# Altium project Servo-Board-v1.0.PrjPcb (part 11 of 19)

## Sheet DIO_2.SchDoc
size 420 x 297 mm; SheetNumber: 20; SheetTotal: 32
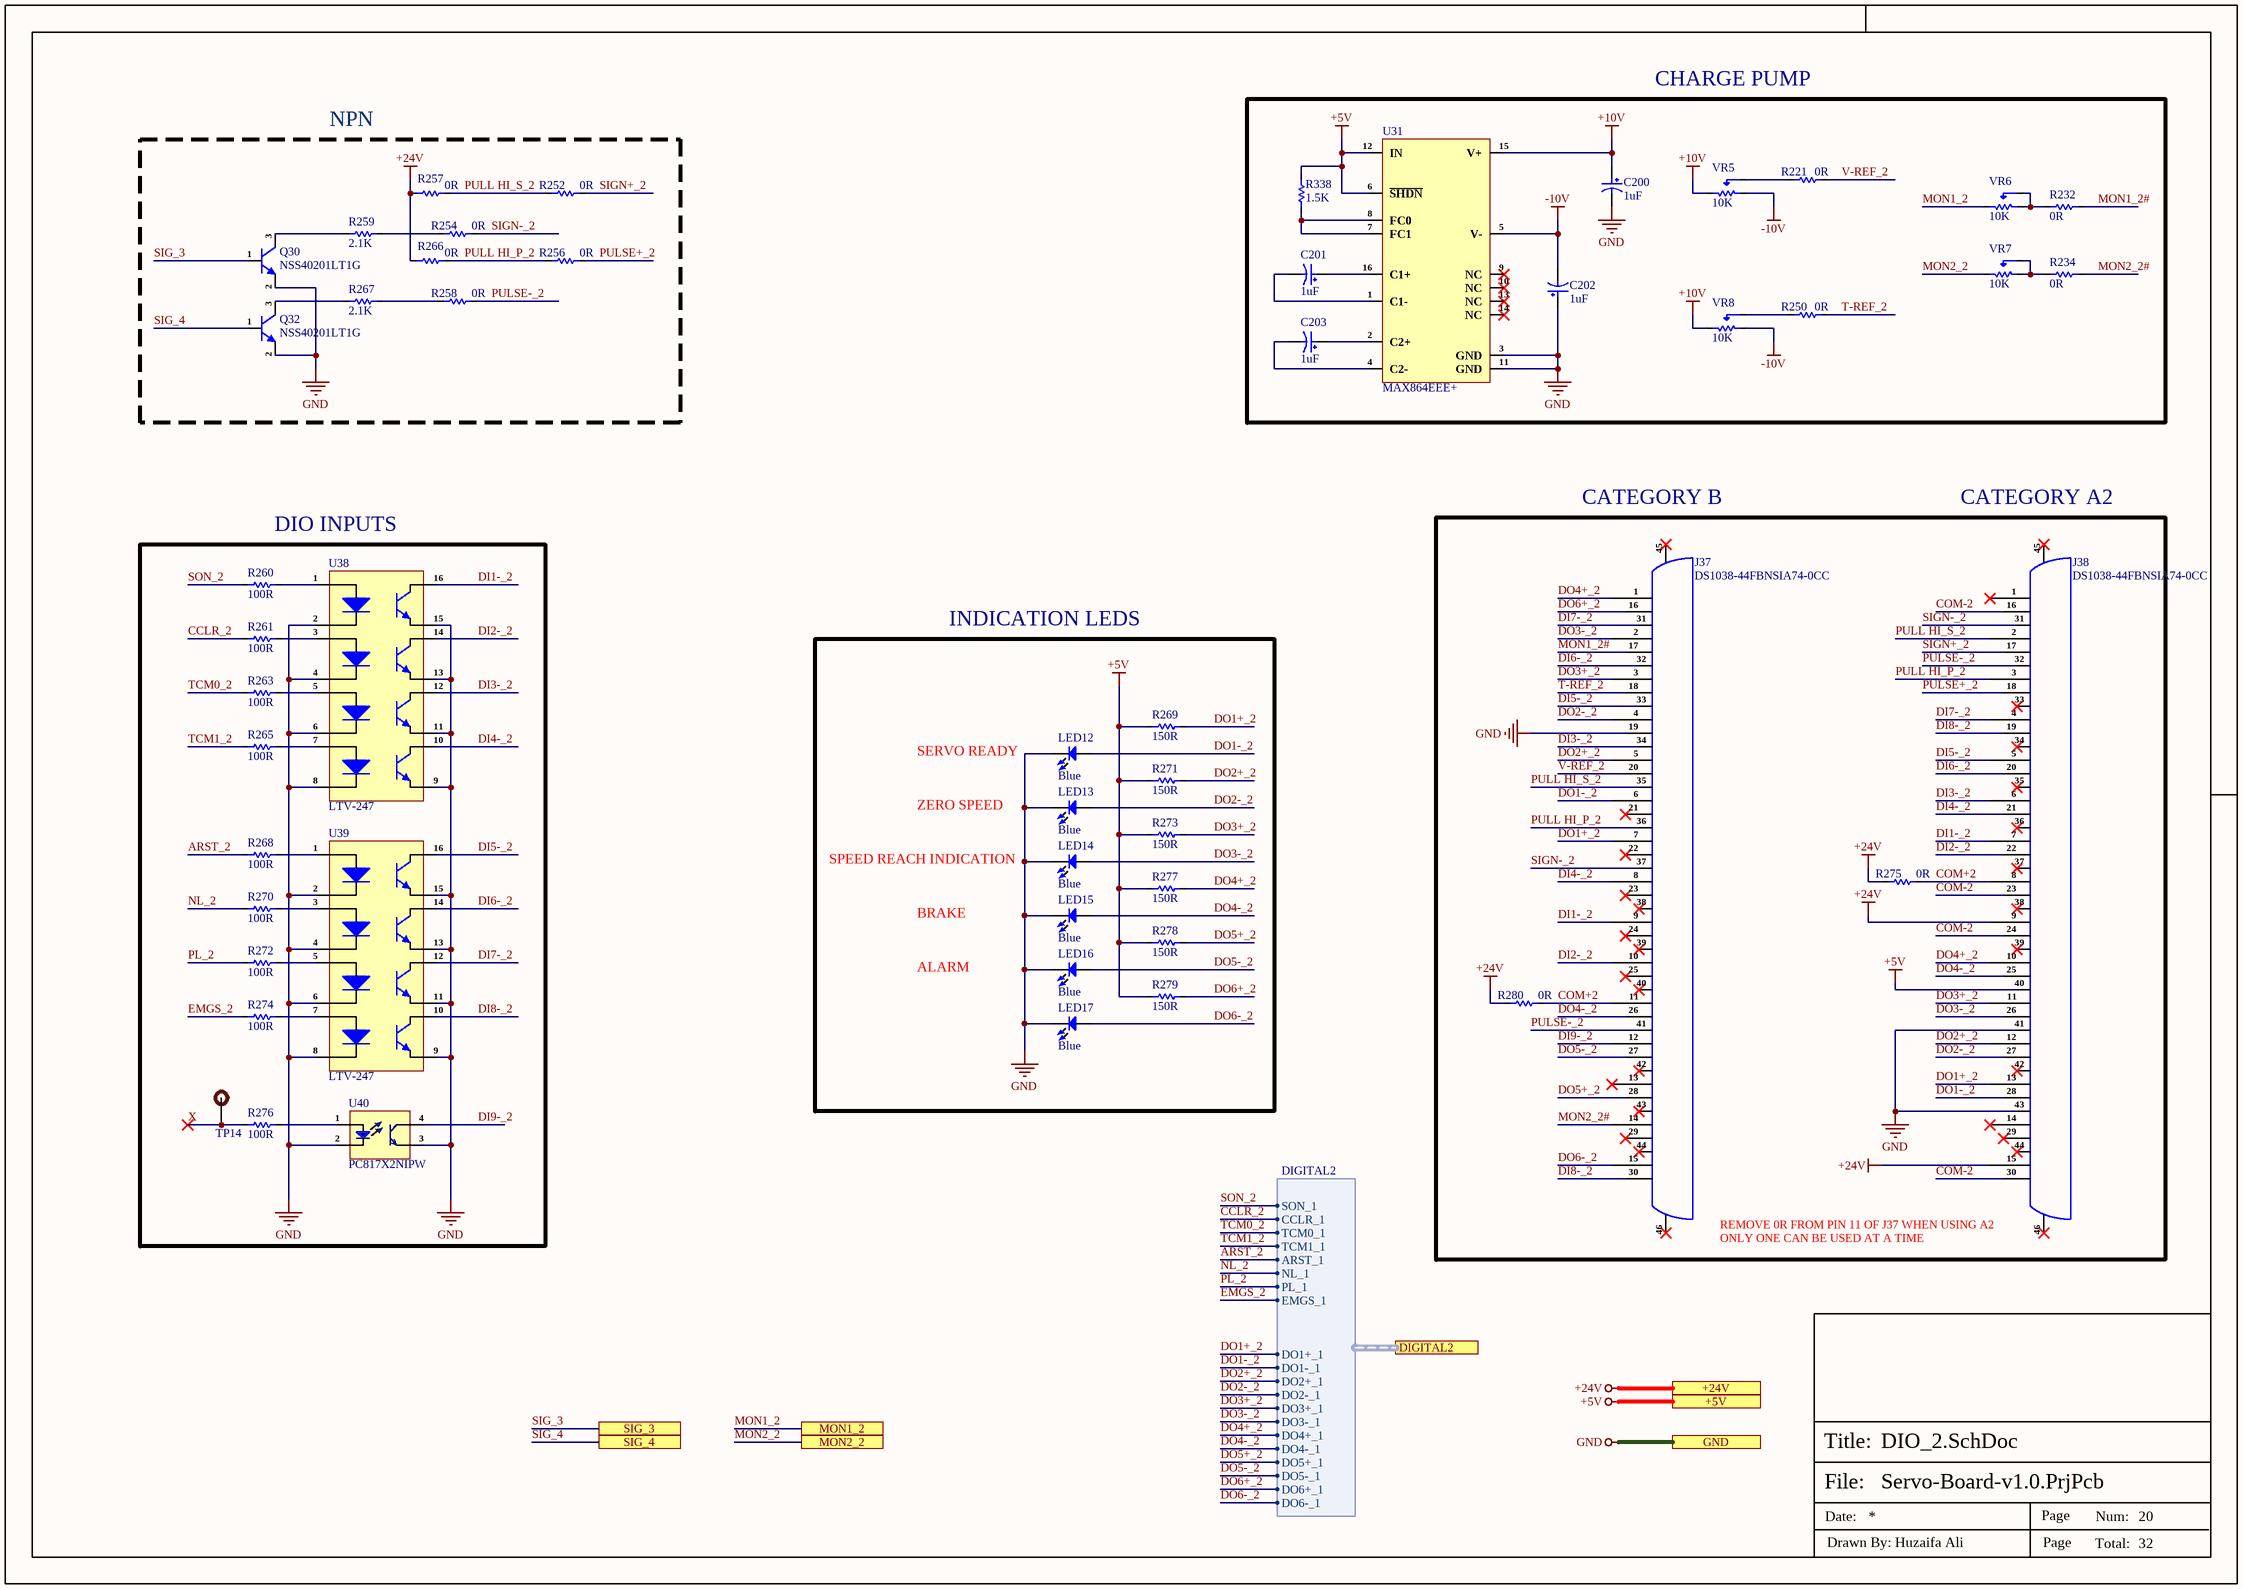
[diagram p19: DIO_2.SchDoc]

### Parts
C200  1uF  [RVT1H1R0M0405]
C201  1uF  [RVT1H1R0M0405]
C202  1uF  [RVT1H1R0M0405]
C203  1uF  [RVT1H1R0M0405]
J37  DS1038-44FBNSIA74-0CC  [DS1038-44FBNSIA74-0CC]
J38  DS1038-44FBNSIA74-0CC  [DS1038-44FBNSIA74-0CC]
LED12  Blue  [LED-0603]
LED13  Blue  [LED-0603]
LED14  Blue  [LED-0603]
LED15  Blue  [LED-0603]
LED16  Blue  [LED-0603]
LED17  Blue  [LED-0603]
Q30  NSS40201LT1G  [SOT-23]
Q32  NSS40201LT1G  [SOT-23]
R221  0R  [Res-0402]
R232  0R  [Res-0402]
R234  0R  [Res-0402]
R250  0R  [Res-0402]
R252  0R  [Res-0603]
R254  0R  [Res-0603]
R256  0R  [Res-0603]
R257  0R  [Res-0603]
R258  0R  [Res-0603]
R259  2.1K  [Res-0603]
R260  100R  [Res-0402]
R261  100R  [Res-0402]
R263  100R  [Res-0402]
R265  100R  [Res-0402]
R266  0R  [Res-0603]
R267  2.1K  [Res-0603]
R268  100R  [Res-0402]
R269  150R  [Res-0603]
R270  100R  [Res-0402]
R271  150R  [Res-0603]
R272  100R  [Res-0402]
R273  150R  [Res-0603]
R274  100R  [Res-0402]
R275  0R  [Res-0402]
R276  100R  [Res-0402]
R277  150R  [Res-0603]
R278  150R  [Res-0603]
R279  150R  [Res-0603]
R280  0R  [Res-0402]
R338  1.5K  [Res-0402]
TP14  TEST POINT  [Test-point]  (value not drawn)  (no BOM)
U31  MAX864EEE+  [16-QSOP]
U38  LTV-247  [16-SO]
U39  LTV-247  [16-SO]
U40  PC817X2NIPW  [PC817X2NIPW]
VR5  10K  [3362P-1-103]
VR6  10K  [3362P-1-103]
VR7  10K  [3362P-1-103]
VR8  10K  [3362P-1-103]

### Blocks framed on the sheet
NPN: Q30 Q32 R252 R254 R256-R259 R266 R267

### Ports
+5V (see Servo2[4C], CAN_Sheet[5D], DIO_1[5D], DIO_3[5D], DIO_4[5D], Encoder_Sheet1[5D], Encoder_Sheet2[5D], Encoder_Sheet3[5D], Encoder_Sheet4[5D], Power_Sheet[5D]), +24V (see Servo2[4C], Connector_Sheet[5D], DIO_1[5D], DIO_3[5D], DIO_4[5D], MOSFET_Driver_Sheet1[5D], MOSFET_Driver_Sheet2[5D], MOSFET_Driver_Sheet3[5D], MOSFET_Driver_Sheet4[5D], Motor_Driver_Sheet1[5D], Motor_Driver_Sheet2[5D], Motor_Driver_Sheet3[5D], Motor_Driver_Sheet4[5D], Power_Sheet[5D]), DIGITAL2 (harness DIGITAL2, see Servo2[4C], Sec_Controller_Sheet2[4D]), GND (see Servo2[4C], CAN_Sheet[5D], Connector_Sheet[5D], Controller_Sheet[5D], DIO_1[5D], DIO_3[5D], DIO_4[5D], Encoder_Sheet1[5D], Encoder_Sheet2[5D], Encoder_Sheet3[5D], Encoder_Sheet4[5D], EtherCAT_Sheet[5D], MOSFET_Driver_Sheet1[5D], MOSFET_Driver_Sheet2[5D], MOSFET_Driver_Sheet3[5D], MOSFET_Driver_Sheet4[5D], Motor_Driver_Sheet1[5D], Motor_Driver_Sheet2[5D], Motor_Driver_Sheet3[5D], Motor_Driver_Sheet4[5D], Power_Sheet[5D], RJ45_Sheet[5D], RS485_RS232_Sheet[3D], Sec_Controller_Sheet1[5D], Sec_Controller_Sheet2[5D], Sec_Controller_Sheet3[5D], Sec_Controller_Sheet4[5D]), MON1_2 (see Servo2[4C], Sec_Controller_Sheet2[3D]), MON2_2 (see Servo2[4C], Sec_Controller_Sheet2[3D]), SIG_3 (see Servo2[4C], Sec_Controller_Sheet2[3D]), SIG_4 (see Servo2[4C], Sec_Controller_Sheet2[3D])

### Harnesses
DIGITAL2: SON_1, TCM0_1, CCLR_1, TCM1_1, ARST_1, NL_1, PL_1, EMGS_1, DO1+_1, DO1-_1, DO2+_1, DO2-_1, DO3+_1, DO3-_1, DO4+_1, DO4-_1, DO5+_1, DO5-_1, DO6+_1, DO6-_1

### Nets
+5V: J38.40 R269.1 R271.1 R273.1 R277.1 R278.1 R279.1 R338.2 U31.6(~{SHDN}) U31.12(IN) ; port +5V
+10V: C200.1 U31.15(V+) VR5.3(CW) VR8.3(CW)
+24V: J38.9 J38.15 R257.1 R266.1 R275.1 R280.1 ; port +24V  [project net VDRAIN]
-10V: C202.2 U31.5(V-) VR5.1(CCW) VR8.1(CCW)
GND: C200.2 C202.1 J37.19 J38.41 J38.43 LED12.2 LED13.2 LED14.2 LED15.2 LED16.2 LED17.2 Q30.2(E) Q32.2(E) U31.3(GND) U31.11(GND) U38.2(K) U38.4(K) U38.6(K) U38.8(K) U38.9(E) U38.11(E) U38.13(E) U38.15(E) U39.2(K) U39.4(K) U39.6(K) U39.8(K) U39.9(E) U39.11(E) U39.13(E) U39.15(E) U40.2(Ca) U40.3(E) ; port GND
ARST_2: R268.1 ; port DIGITAL2.ARST_1
CCLR_2: R261.1 ; port DIGITAL2.CCLR_1
COM+2: J37.11 J38.8 R275.2 R280.2
COM-2: J38.16 J38.23 J38.24 J38.30
DI1-_2: J37.9 J38.7 U38.16(C)
DI2-_2: J37.10 J38.22 U38.14(C)
DI3-_2: J37.34 J38.6 U38.12(C)
DI4-_2: J37.8 J38.21 U38.10(C)
DI5-_2: J37.33 J38.5 U39.16(C)
DI6-_2: J37.32 J38.20 U39.14(C)
DI7-_2: J37.31 J38.4 U39.12(C)
DI8-_2: J37.30 J38.19 U39.10(C)
DI9-_2: J37.12 U40.4(C)
DO1+_2: J37.7 J38.13 R269.2 ; port DIGITAL2.DO1+_1
DO1-_2: J37.6 J38.28 LED12.1 ; port DIGITAL2.DO1-_1
DO2+_2: J37.5 J38.12 R271.2 ; port DIGITAL2.DO2+_1
DO2-_2: J37.4 J38.27 LED13.1 ; port DIGITAL2.DO2-_1
DO3+_2: J37.3 J38.11 R273.2 ; port DIGITAL2.DO3+_1
DO3-_2: J37.2 J38.26 LED14.1 ; port DIGITAL2.DO3-_1
DO4+_2: J37.1 J38.10 R277.2 ; port DIGITAL2.DO4+_1
DO4-_2: J37.26 J38.25 LED15.1 ; port DIGITAL2.DO4-_1
DO5+_2: J37.28 R278.2 ; port DIGITAL2.DO5+_1
DO5-_2: J37.27 LED16.1 ; port DIGITAL2.DO5-_1
DO6+_2: J37.16 R279.2 ; port DIGITAL2.DO6+_1
DO6-_2: J37.15 LED17.1 ; port DIGITAL2.DO6-_1
EMGS_2: R274.1 ; port DIGITAL2.EMGS_1
MON1_2: VR6.3(CW) ; port MON1_2
MON1_2#: J37.17 R232.2
MON2_2: VR7.3(CW) ; port MON2_2
MON2_2#: J37.14 R234.2
NL_2: R270.1 ; port DIGITAL2.NL_1
PL_2: R272.1 ; port DIGITAL2.PL_1
PULL HI_P_2: J37.36 J38.3 R256.1 R266.2
PULL HI_S_2: J37.35 J38.2 R252.1 R257.2
PULSE+_2: J38.18 R256.2
PULSE-_2: J37.41 J38.32 R258.2
SIG_3: Q30.1(B) ; port SIG_3
SIG_4: Q32.1(B) ; port SIG_4
SIGN+_2: J38.17 R252.2
SIGN-_2: J37.37 J38.31 R254.2
SON_2: R260.1 ; port DIGITAL2.SON_1
T-REF_2: J37.18 R250.2
TCM0_2: R263.1 ; port DIGITAL2.TCM0_1
TCM1_2: R265.1 ; port DIGITAL2.TCM1_1
V-REF_2: J37.20 R221.2
X: R276.1 TP14.1
NetC201_1: C201.1 U31.16(C1+)
NetC201_2: C201.2 U31.1(C1-)
NetC203_1: C203.1 U31.2(C2+)
NetC203_2: C203.2 U31.4(C2-)
NetQ30_3: Q30.3(C) R259.1
NetQ32_3: Q32.3(C) R267.1
NetR221_1: R221.1 VR5.2(Wiper)
NetR232_1: R232.1 VR6.1(CCW) VR6.2(Wiper)
NetR234_1: R234.1 VR7.1(CCW) VR7.2(Wiper)
NetR250_1: R250.1 VR8.2(Wiper)
NetR254_1: R254.1 R259.2
NetR258_1: R258.1 R267.2
NetR260_2: R260.2 U38.1(A)
NetR261_2: R261.2 U38.3(A)
NetR263_2: R263.2 U38.5(A)
NetR265_2: R265.2 U38.7(A)
NetR268_2: R268.2 U39.1(A)
NetR270_2: R270.2 U39.3(A)
NetR272_2: R272.2 U39.5(A)
NetR274_2: R274.2 U39.7(A)
NetR276_2: R276.2 U40.1(An)
NetR338_1: R338.1 U31.7(FC1) U31.8(FC0)

Not connected (* = marked no-connect by the designer): J37 13* 21* 22* 23* 24* 25* 29* 38* 39* 40* 42* 43* 44* 45* 46*; J38 1* 14* 29* 33* 34* 35* 36* 37* 38* 39* 42* 44* 45* 46*; U31 9(NC)* 10(NC)* 13(NC)* 14(NC)*

### Notes on the sheet
- CHARGE PUMP
- DIO INPUTS
- (near J37) CATEGORY B
- (near J38) CATEGORY A2
- INDICATION LEDS
- SERVO READY
- SPEED REACH INDICATION
- ZERO SPEED
- BRAKE
- ALARM
- REMOVE 0R FROM PIN 11 OF J37 WHEN USING A2
- ONLY ONE CAN BE USED AT A TIME
- File:
- Title:
- Date:
- Page
- Num:
- Total:
- Drawn By: Huzaifa Ali

### Library data of the parts
C200-C203 = RVT1H1R0M0405: 1uF 50V 8mA@120Hz ±20% SMD,D4xL5.4mm Aluminum Electrolytic Capacitors - SMD ROHS; Manufacturer: Roqang; Supplier: LCSC; LCSC Part Number: C72491; Manufacturer Part Number: RVT1H1R0M0405; RoHS: No
J37 J38 = DS1038-44FBNSIA74-0CC: 44P Female D-Sub Right-Angle 3 1.5A -40℃~+105℃ Push-Pull D-Sub / VGA connector ROHS; Manufacturer: CONNFLY Elec; Manufacturer Part Number: DS1038-44FBNSIA74-0CC; Package: Push-Pull; LCSC Part Number: C77844; Item Type: D-Sub / VGA connector; ComponentLink1Description: LCSC; ComponentLink1URL: https://www.lcsc.com/product-detail/D-Sub-VGA-connector_CONNFLY-Elec-DS1038-44FBNSIA74-0CC_C77844.html
LED12-LED17 = NCD0603B3: blue 0603 Light Emitting Diodes (LED) ROHS; Manufacturer: Foshan NationStar Optoelectronics; Manufacturer Part Number: NCD0603B3; Package: 0603; LCSC Part Number: C158101; Item Type: LED; ComponentLink1Description: LCSC; ComponentLink1URL: https://www.lcsc.com/product-detail/Light-Emitting-Diodes-LED_Foshan-NationStar-Optoelectronics-NCD0603B3_C158101.html
Q30 Q32 = NSS40201LT1G: TRANS NPN 40V 2A SOT23-3; Manufacturer: ON Semiconductor; Max Power Dissipation: 540mW; Transition Frequency: 150MHz; hFE Min: 200; Number of Elements: 1; Emitter Base Voltage (VEBO): 6V; Collector Emitter Saturation Voltage: 115mV; Element Configuration: Single; Clock Frequency: 100MHz; Item Type: Transistor; Supplier 1: Future Electronics; Manufacturer Part Number: NSS40201LT1G; RoHS: Yes; Category: BJTs; Stock 1: 155; Pricing 1: 1=0.42000, 15=0.34000, 75=0.29500, 300=0.25500, 1500=0.21000 (USD); Case/Package: SOT-23-3; Pins: 3; Min Operating Temperature: -55°C; Max Operating Temperature: 150°C; Collector Emitter Voltage (VCEO): 40V; Packaging: Tape and Reel; Max Collector Current: 2A; Collector Emitter Breakdown Voltage: 40V; Polarity: NPN; Package Quantity: 3000; Frequency: 150MHz; Max Breakdown Voltage: 40V; Collector Base Voltage (VCBO): 40V; Power Dissipation: 540mW; Gain Bandwidth Product: 150MHz; Series: -; Collector-emitter Voltage-Max: 115mV; Length: 3.04mm; Width: 2.64mm; Height: 1.11mm; Radiation Hardening: No; Lead Free: Lead Free; Reach SVHC Compliant: Yes; Halogen Free: Halogen Free; RoHS Compliant: Yes; ComponentLink1URL: https://datasheet.ciiva.com/976/nss40201l-d-976800.pdf?src-supplier=Digi-Key; ComponentLink1Description: https://datasheet.ciiva.com/976/nss40201l-d-976800.pdf?src-supplier=Digi-Key; ComponentLink2URL: https://datasheet.ciiva.com/11204/nss40201l-d-11204882.pdf?src-supplier=Avnet; ComponentLink2Description: https://datasheet.ciiva.com/11204/nss40201l-d-11204882.pdf?src-supplier=Avnet; ComponentLink3URL: https://datasheet.ciiva.com/16291/nss40201l-d-115376-16291797.pdf?src-supplier=Mouser; ComponentLink3Description: https://datasheet.ciiva.com/16291/nss40201l-d-115376-16291797.pdf?src-supplier=Mouser; ComponentLink4URL: https://datasheet.ciiva.com/30480/0900766b8121b5a5-30480502.pdf?src-supplier=Rs; ComponentLink4Description: https://datasheet.ciiva.com/30480/0900766b8121b5a5-30480502.pdf?src-supplier=Rs; ComponentLink5URL: https://datasheet.ciiva.com/976/nss40201l-d-976801.pdf?src-supplier=Digi-Key; ComponentLink5Description: https://datasheet.ciiva.com/976/nss40201l-d-976801.pdf?src-supplier=Digi-Key; ComponentLink6URL: https://datasheet.ciiva.com/976/nss40201l-d-976802.pdf?src-supplier=Digi-Key; ComponentLink6Description: https://datasheet.ciiva.com/976/nss40201l-d-976802.pdf?src-supplier=Digi-Key; ComponentLink7URL: https://datasheet.ciiva.com/22641/nss40201l-d-22641179.pdf?src-supplier=Farnell; ComponentLink7Description: https://datasheet.ciiva.com/22641/nss40201l-d-22641179.pdf?src-supplier=Farnell; ComponentLink8URL: https://datasheet.ciiva.com/16222/nss40201l-d-16222093.pdf?src-supplier=Future+Electronics; ComponentLink8Description: https://datasheet.ciiva.com/16222/nss40201l-d-16222093.pdf?src-supplier=Future+Electronics; Supplier Part Number 1: 6030674; LCSC Part Number: C145175
R221 R232 R234 R250 R275 R280 = RC0402FR-070RL: as R54 on sheet Sec_Controller_Sheet2; Supplier 1: Mouser; Manufacturer Part Number: RC0402FR-070RL; RoHS: Yes; Stock 1: 8556842; Pricing 1: 1=0.10000, 10=0.01400, 50=0.01400, 100=0.00600, 1000=0.00300, 5000=0.00200, 10000=0.00100 (USD); Mount: Surface Mount; Case/Package: 0402; Contact Plating: Tin,Matte; Case Code (Imperial): 0402; Case Code (Metric): 1005; Size Code: 0402; Min Operating Temperature: -55°C; Max Operating Temperature: 155°C; Resistance: 0R; Resistor Type: Thick Film; Packaging: Tape and Reel; Termination: SMD/SMT; Features: Moisture Resistant; Series: RC; Number of Terminations: 2; Length: 1mm; Width: 0.5mm; Height: 0.35mm; Radiation Hardening: No; Lead Free: Lead Free; RoHS Compliant: Yes; ComponentLink1URL: https://datasheet.ciiva.com/8896/pyu-rc0402-51-rohs-l-6-8896149.pdf?src-supplier=Avnet; ComponentLink1Description: https://datasheet.ciiva.com/8896/pyu-rc0402-51-rohs-l-6-8896149.pdf?src-supplier=Avnet; ComponentLink2URL: https://datasheet.ciiva.com/16790/pyu-rc0402-51-rohs-l-6-r-16790444.pdf?src-supplier=Future+Electronics; ComponentLink2Description: https://datasheet.ciiva.com/16790/pyu-rc0402-51-rohs-l-6-r-16790444.pdf?src-supplier=Future+Electronics; Supplier Part Number 1: 603-RC0402FR-070RL; LCSC Part Number: C106231
R252 R254 R256-R258 R266 = RC0603JR-070RL: as R55-R57 on sheet Sec_Controller_Sheet2; Supplier 1: Digi-Key; Manufacturer Part Number: RC0603JR-070RL; RoHS: Yes; Category: Chip SMD Resistors; Stock 1: 18081776; Pricing 1: 1=0.10000, 10=0.01700, 25=0.01240, 50=0.00960, 100=0.00700, 250=0.00536, 500=0.00430, 1000=0.00316 (USD); Case/Package: 0603; Number of Pins: 2; Contact Plating: Tin,Matte; Case Code (Imperial): 0603; Case Code (Metric): 1608; Size Code: 0603; Min Operating Temperature: -55°C; Max Operating Temperature: 155°C; Resistor Type: Thick Film; Packaging: Tape and Reel; Termination: SMD/SMT; Series: RC; Technology: THICK FILM; Package Quantity: 5000; Voltage Rating: 50V; Features: Moisture Resistant; Max Power Dissipation: 100mW; Number of Terminations: 2; Construction: Rectangular; Length: 1.6mm; Width: 0.8mm; Height: 0.45mm; Depth: 0.8mm; Radiation Hardening: No; Reach SVHC Compliant: No SVHC; Lead Free: Lead Free; RoHS Compliant: Yes; Military Standard: Not; Supplier Part Number 1: 311-0.0GRCT-ND; LCSC Part Number: C95177
R259 R267 = RT0603BRD072K1L: RES SMD 2.1K OHM 0.1% 1/10W 0603; Manufacturer: Yageo; Resistance: 2.1kR; Voltage Rating: 75V; Power Rating: 100mW; Temperature Coefficient: 25ppm/°C; Voltage Rating (DC): 50V; Item Type: Resistor; Supplier 1: Arrow Electronics; Manufacturer Part Number: RT0603BRD072K1L; RoHS: Yes; Category: Chip SMD Resistors; Stock 1: 4891; Pricing 1: 1=0.32000, 10=0.26320, 25=0.26040, 100=0.10310, 250=0.10280, 500=0.10180, 1000=0.06110, 3000=0.03900 (USD); Case/Package: 0603; Case Code (Imperial): 0603; Case Code (Metric): 1608; Min Operating Temperature: -55°C; Max Operating Temperature: 125°C; Tolerance: 0.1%; Packaging: Tape and Reel; Resistor Type: Thin Film; Number of Terminations: 2; Termination: SMD/SMT; Max Power Dissipation: 100mW; Features: Moisture Resistant; Series: RT; Construction: Rectangular; Length: 0.063inch; Width: 0.031inch; Height: 0.022inch; Depth: 0.8mm; Military Standard: Not; Lead Free: Lead Free; RoHS Compliant: Yes; ComponentLink1URL: https://datasheet.ciiva.com/12723/pyu-rt-1-to-0-05-rohs-l-4-12723880.pdf?src-supplier=Mouser; ComponentLink1Description: https://datasheet.ciiva.com/12723/pyu-rt-1-to-0-05-rohs-l-4-12723880.pdf?src-supplier=Mouser; Supplier Part Number 1: RT0603BRD072K1L; LCSC Part Number: C861293
R260 R261 R263 R265 R268 R270 R272 R274 R276 = RC0402FR-07100RL: RES 100 OHM 1% 1/16W 0402; Manufacturer: Yageo; Power Rating: 62.5mW; Voltage Rating: 50V; Temperature Coefficient: 100ppm/°C; Max Power Dissipation: 63mW; Item Type: Resistor; Supplier 1: Mouser; Manufacturer Part Number: RC0402FR-07100RL; RoHS: Yes; Category: Chip SMD Resistors; Stock 1: 699545; Pricing 1: 1=0.10000, 10=0.01200, 50=0.01200, 100=0.00500, 1000=0.00300, 2500=0.00200, 10000=0.00100 (USD); Case/Package: 0402; Number of Pins: 2; Case Code (Imperial): 0402; Case Code (Metric): 1005; Size Code: 0402; Min Operating Temperature: -55°C; Max Operating Temperature: 155°C; Tolerance: 1%; Voltage Rating (DC): 50V; Resistance: 100R; Packaging: Tape and Reel; Termination: SMD/SMT; Resistor Type: Thick Film; Features: Moisture Resistant; Series: RC; Number of Terminations: 2; Resistance Tolerance: 1%; Construction: Rectangular; Technology: THICK FILM; Length: 1mm; Width: 0.5mm; Height: 0.32mm; Depth: 0.5mm; RoHS Compliant: Yes; REACH SVHC: No SVHC; Military Standard: Not; Lead Free: Lead Free; ComponentLink1URL: https://datasheet.ciiva.com/11808/0900766b80c66297-11808765.pdf?src-supplier=RSComponents; ComponentLink1Description: https://datasheet.ciiva.com/11808/0900766b80c66297-11808765.pdf?src-supplier=RSComponents; ComponentLink2URL: https://datasheet.ciiva.com/7849/1784430-7849810.pdf?src-supplier=Element14; ComponentLink2Description: https://datasheet.ciiva.com/7849/1784430-7849810.pdf?src-supplier=Element14; ComponentLink3URL: https://datasheet.ciiva.com/28367/1018594-28367226.pdf?src-supplier=Element14; ComponentLink3Description: https://datasheet.ciiva.com/28367/1018594-28367226.pdf?src-supplier=Element14; ComponentLink4URL: https://datasheet.ciiva.com/22747/1018594-22747511.pdf?src-supplier=Element14; ComponentLink4Description: https://datasheet.ciiva.com/22747/1018594-22747511.pdf?src-supplier=Element14; ComponentLink5URL: https://datasheet.ciiva.com/12667/pyu-rc0402-51-rohs-l-6-r-12667957.pdf?src-supplier=Mouser; ComponentLink5Description: https://datasheet.ciiva.com/12667/pyu-rc0402-51-rohs-l-6-r-12667957.pdf?src-supplier=Mouser; ComponentLink6URL: https://datasheet.ciiva.com/15189/getdatasheetpartid-329466-15189335.pdf?src-supplier=Verical; ComponentLink6Description: https://datasheet.ciiva.com/15189/getdatasheetpartid-329466-15189335.pdf?src-supplier=Verical; ComponentLink7URL: https://datasheet.ciiva.com/16740/pyu-rc0402-51-rohs-l-6-r-16740566.pdf?src-supplier=Future+Electronics; ComponentLink7Description: https://datasheet.ciiva.com/16740/pyu-rc0402-51-rohs-l-6-r-16740566.pdf?src-supplier=Future+Electronics; Supplier Part Number 1: 603-RC0402FR-07100RL; LCSC Part Number: C106232
R269 R271 R273 R277-R279 = RC0603DR-07150RL: RES 150 OHM 0.5% 1/10W 0603; Manufacturer: Yageo; Max Power Dissipation: 100mW; Temperature Coefficient: 100ppm/°C; Item Type: Resistor; Supplier 1: Avnet; Manufacturer Part Number: RC0603DR-07150RL; RoHS: Yes; Category: Chip SMD Resistors; Pricing 1: 5000=0.00430, 10000=0.00424, 20000=0.00411 (USD); Case/Package: 0603; Min Operating Temperature: -55°C; Max Operating Temperature: 155°C; Packaging: Tape and Reel; Resistance: 150R; Resistor Type: Thick Film; Number of Terminations: 2; Tolerance: 0.5%; Features: Moisture Resistant; Length: 0.063inch; Width: 0.031inch; Height: 0.022inch; RoHS Compliant: Yes; ComponentLink1URL: http://www.yageo.com.tw/exep/pages/download/literatures/PYu-R_INT-thick_7.pdf?src-supplier=Digi-Key; ComponentLink1Description: http://www.yageo.com.tw/exep/pages/download/literatures/PYu-R_INT-thick_7.pdf?src-supplier=Digi-Key; Supplier Part Number 1: RC0603DR-07150RL; LCSC Part Number: C471801
R338 = RC0402FR-071K5L: RES 1.5K OHM 1% 1/16W 0402; Manufacturer: Yageo; Resistance: 1.5kR; Power Rating: 62.5mW; Voltage Rating: 50V; Temperature Coefficient: 100ppm/°C; Max Power Dissipation: 63mW; Supplier 1: Digi-Key; Manufacturer Part Number: RC0402FR-071K5L; RoHS: Yes; Category: Chip SMD Resistors; Stock 1: 2832947; Pricing 1: 1=0.10000, 10=0.01500, 100=0.00610, 1000=0.00275, 2500=0.00239, 5000=0.00197 (USD); Case/Package: 0402; Case Code (Metric): 1005; Case Code (Imperial): 0402; Size Code: 0402; Min Operating Temperature: -55°C; Max Operating Temperature: 155°C; Resistor Type: Thick Film; Package Quantity: 1; Tolerance: 1%; Packaging: Tape and Reel; Number of Terminations: 2; Termination: SMD/SMT; Features: Moisture Resistant; Series: RC; Resistance Tolerance: 1%; Construction: Rectangular; Technology: THICK FILM; Length: 1mm; Width: 0.02inch; Height: 0.016inch; Depth: 0.5mm; RoHS Compliant: Yes; REACH SVHC: No SVHC; Military Standard: Not; Lead Free: Lead Free; ComponentLink1URL: https://datasheet.ciiva.com/11808/0900766b80c66297-11808238.pdf?src-supplier=RSComponents; ComponentLink1Description: https://datasheet.ciiva.com/11808/0900766b80c66297-11808238.pdf?src-supplier=RSComponents; ComponentLink2URL: https://datasheet.ciiva.com/46394/1018594-46394950.pdf?src-supplier=Element14; ComponentLink2Description: https://datasheet.ciiva.com/46394/1018594-46394950.pdf?src-supplier=Element14; ComponentLink3URL: https://datasheet.ciiva.com/2453/pyu-r-int-thick-7-2453440.pdf?src-supplier=Digi-Key; ComponentLink3Description: https://datasheet.ciiva.com/2453/pyu-r-int-thick-7-2453440.pdf?src-supplier=Digi-Key; ComponentLink4URL: https://datasheet.ciiva.com/2453/pyu-r-int-thick-7-2453441.pdf?src-supplier=Digi-Key; ComponentLink4Description: https://datasheet.ciiva.com/2453/pyu-r-int-thick-7-2453441.pdf?src-supplier=Digi-Key; ComponentLink5URL: https://datasheet.ciiva.com/2453/pyu-r-int-thick-7-2453439.pdf?src-supplier=Digi-Key; ComponentLink5Description: https://datasheet.ciiva.com/2453/pyu-r-int-thick-7-2453439.pdf?src-supplier=Digi-Key; ComponentLink6URL: https://datasheet.ciiva.com/12558/pyu-rc0402-51-rohs-l-6-r-8721-12558542.pdf?src-supplier=Mouser; ComponentLink6Description: https://datasheet.ciiva.com/12558/pyu-rc0402-51-rohs-l-6-r-8721-12558542.pdf?src-supplier=Mouser; ComponentLink7URL: https://datasheet.ciiva.com/7849/1018594-7849863.pdf?src-supplier=Element14; ComponentLink7Description: https://datasheet.ciiva.com/7849/1018594-7849863.pdf?src-supplier=Element14; ComponentLink8URL: https://datasheet.ciiva.com/7849/1018594-7849864.pdf?src-supplier=Element14; ComponentLink8Description: https://datasheet.ciiva.com/7849/1018594-7849864.pdf?src-supplier=Element14; ComponentLink9URL: https://datasheet.ciiva.com/15189/getdatasheetpartid-323992-15189370.pdf?src-supplier=Verical; ComponentLink9Description: https://datasheet.ciiva.com/15189/getdatasheetpartid-323992-15189370.pdf?src-supplier=Verical; Supplier Part Number 1: 311-1.50KLRCT-ND; LCSC Part Number: C114759
TP14 = TEST POINT: Test Point ON; Item Type: TEST POINT
U31 = MAX864EEE+: IC REG CHARGE PUMP INV 16QSOP; Manufacturer: Maxim; Output Current: 20mA; Output Voltage: 12V; Logic Function: Inverting; Number of Outputs: 2; Switching Frequency: 185kHz; Synchronous Rectifier: No; Topology: Boost; Output Type: Adjustable; Max Supply Voltage: 6V; Min Supply Voltage: 1.75V; Operating Supply Current: 7mA; Min Output Voltage: 3.5V; Supplier: Digikey; Supplier Part Number: MAX864EEE+-ND; Manufacturer Part Number: MAX864EEE+; RoHS: Yes; Item Type: IC; Stock: 443; Pricing: 1=4.9, 10=4.399, 25=4.1588, 100=3.6042, 300=3.41937, 500=3.06818, 1000=2.58762, 2500=2.45824 (USD); Mounting Technology: Surface Mount; Case/Package: QSOP; Pins: 16; Weight: 0.010159oz; Min Operating Temperature: -40°C; Max Operating Temperature: 85°C; Packaging: Rail/Tube; Package Quantity: 100; Series: -; Min Input Voltage: 1.75V; Max Output Voltage: 12V; Termination: SMD/SMT; Length: 4.98mm; Width: 3.99mm; Height: 1.55mm; Radiation Hardening: No; Lead Free: Lead Free; RoHS Compliant: Yes; Reach SVHC Compliant: No; ComponentLink1URL: https://datasheet.ciiva.com/3215/max864-3215728.pdf?src-supplier=Avnet; ComponentLink1Description: https://datasheet.ciiva.com/3215/max864-3215728.pdf?src-supplier=Avnet; ComponentLink2URL: https://datasheet.ciiva.com/3216/max864-3216791.pdf?src-supplier=Avnet; ComponentLink2Description: https://datasheet.ciiva.com/3216/max864-3216791.pdf?src-supplier=Avnet; ComponentLink3URL: https://datasheet.ciiva.com/4874/max864-4874972.pdf?src-supplier=Mouser; ComponentLink3Description: https://datasheet.ciiva.com/4874/max864-4874972.pdf?src-supplier=Mouser; ComponentLink4URL: https://datasheet.ciiva.com/7994/9917-7994860.pdf?src-supplier=Element14; ComponentLink4Description: https://datasheet.ciiva.com/7994/9917-7994860.pdf?src-supplier=Element14
U38 U39 = LTV-247: OPTOISO 3.75KV 4CH TRANS 16SO; Manufacturer: Vishay Lite-On; Number of Channels: 4; Collector Emitter Voltage (VCEO): 80V; Reverse Breakdown Voltage: 6V; Forward Voltage: 1.2V; Forward Current: 20mA; Max Power Dissipation: 200mW; Output Current per Channel: 50mA; Collector Emitter Saturation Voltage: 400mV; Power Dissipation: 170mW; Current Transfer Ratio: 600%; Item Type: PhotoTransistor; Supplier 1: Future Electronics; Manufacturer Part Number: LTV-247; RoHS: Yes; Category: Optocouplers; Stock 1: 178000; Pricing 1: 2000=0.77000 (USD); Mount: Surface Mount; Case/Package: SMD/SMT; Number of Pins: 16; Min Operating Temperature: -55°C; Max Operating Temperature: 110°C; Package Quantity: 2000; Packaging: Tape and Reel; Max Output Voltage: 80V; Max Collector Current: 50mA; Number of Elements: 4; Max Input Current: 50mA; Radiation Hardening: No; RoHS Compliant: Yes; ComponentLink1URL: https://datasheet.ciiva.com/24015/ltv-247-256860-24015561.pdf?src-supplier=Mouser; ComponentLink1Description: https://datasheet.ciiva.com/24015/ltv-247-256860-24015561.pdf?src-supplier=Mouser; ComponentLink2URL: https://datasheet.ciiva.com/29730/ltv-214-244-29730320.pdf?src-supplier=Digi-Key; ComponentLink2Description: https://datasheet.ciiva.com/29730/ltv-214-244-29730320.pdf?src-supplier=Digi-Key; Supplier Part Number 1: 3051235; LCSC Part Number: C115451; ComponentLink3Description: LCSC; ComponentLink3URL: https://www.lcsc.com/product-detail/Optocouplers-Phototransistor-Output_Lite-On-LTV-247_C115451.html
U40 = PC817X2NIPW: Optoisolator Output Channel 4-SMD; Manufacturer: Sharp; Item Type: IC; Supplier: Mouser; Supplier Part Number: 852-PC817X2NIPW; Manufacturer Part Number: PC817X2NIPW; RoHS: No; Pricing: 1=0.54, 10=0.352, 50=0.352, 100=0.233, 1000=0.185, 10000=0.146 (USD); LCSC Part Number: C2840443
VR5-VR8 = 3362P-1-103: TRIMMER 10K OHM 0.5W PC PIN TOP; Manufacturer: Bourns; Item Type: Potentiometer; Supplier: Mouser; LCSC Part Number: C118956; Manufacturer Part Number: 3362P-1-103; RoHS: No; Stock: 1436; Pricing: 1=1.97, 10=1.44, 50=1.44, 100=1.13, 1000=0.756, 10000=0.756 (USD); ComponentLink1URL: https://datasheet.ciiva.com/19466/1931499-19466806.pdf?src-supplier=Jameco; ComponentLink1Description: https://datasheet.ciiva.com/19466/1931499-19466806.pdf?src-supplier=Jameco; ComponentLink2URL: https://datasheet.ciiva.com/3266/3362-3266710.pdf?src-supplier=Avnet; ComponentLink2Description: https://datasheet.ciiva.com/3266/3362-3266710.pdf?src-supplier=Avnet; ComponentLink3URL: https://datasheet.ciiva.com/2161/3362-2161230.pdf?src-supplier=Digikey; ComponentLink3Description: https://datasheet.ciiva.com/2161/3362-2161230.pdf?src-supplier=Digikey

## Sheet Servo3.SchDoc
size 420 x 297 mm; SheetNumber: 21; SheetTotal: 32
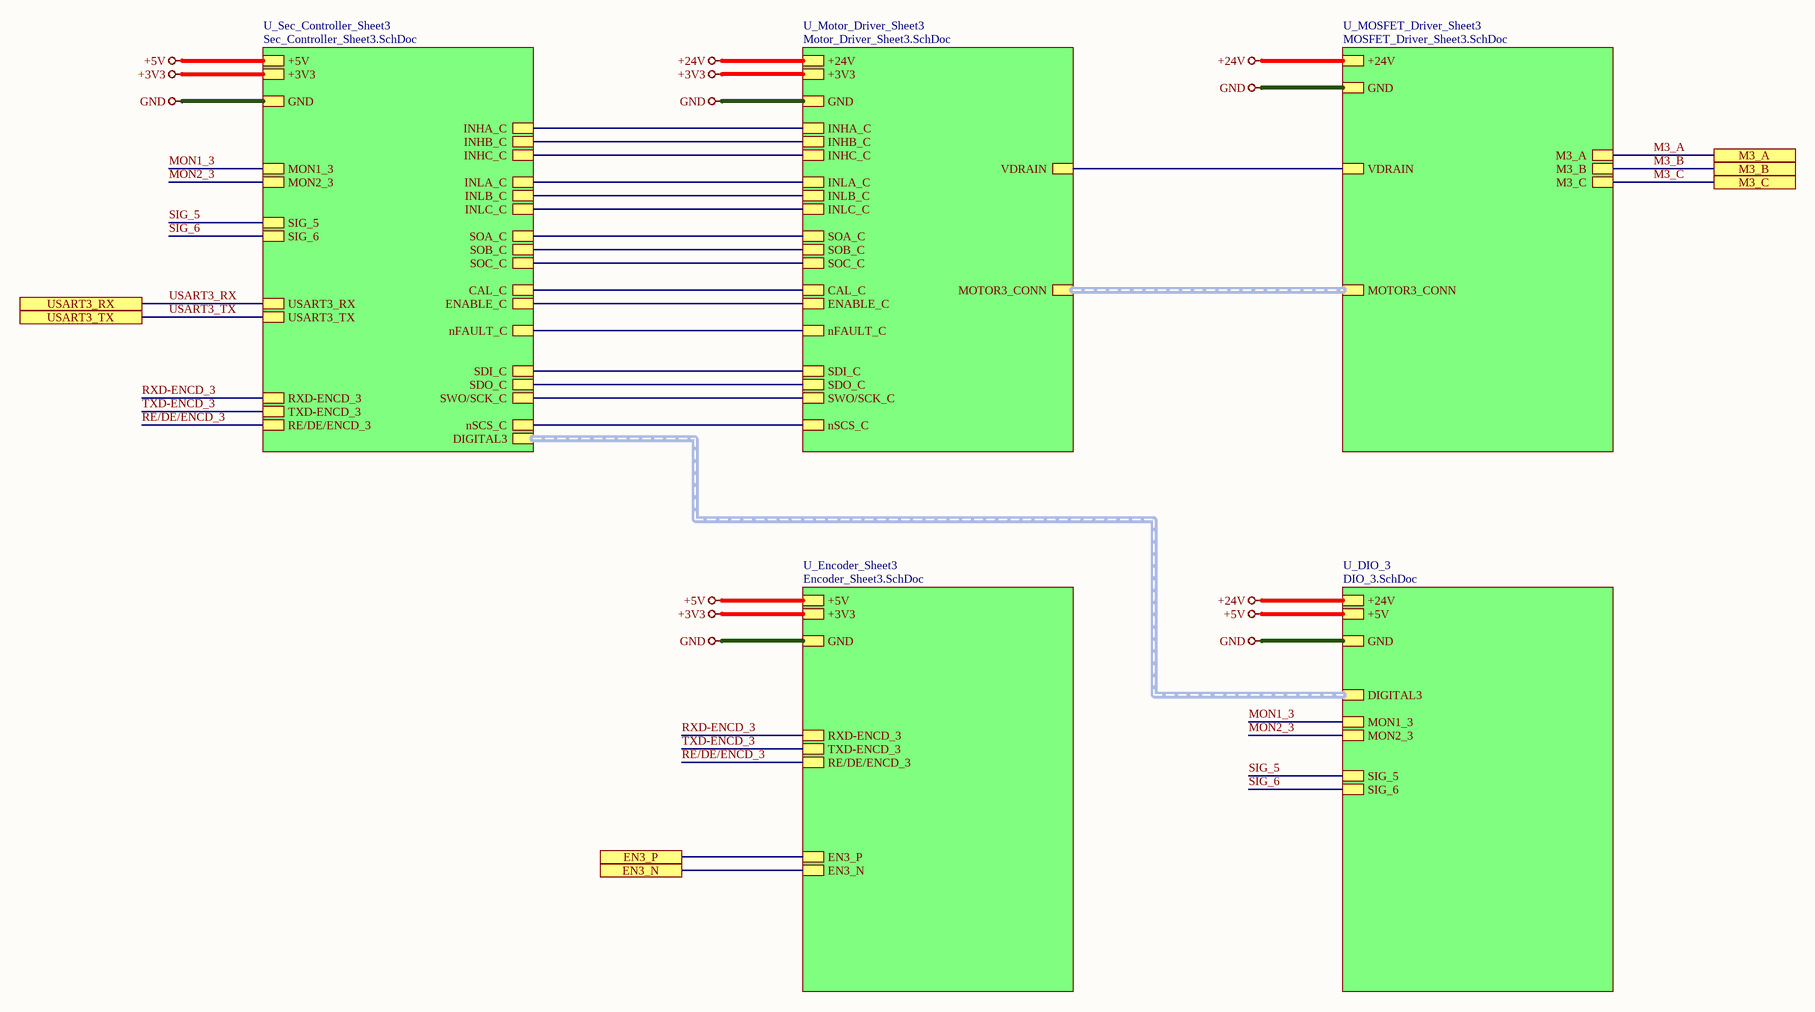
[diagram p20: Servo3.SchDoc]

### Sub-sheets
U_DIO_3 = DIO_3.SchDoc: +24V, +5V, GND, MON1_3, MON2_3, SIG_5, SIG_6, DIGITAL3 (harness DIGITAL1)
U_Encoder_Sheet3 = Encoder_Sheet3.SchDoc: +3V3, +5V, GND, EN3_N, EN3_P, RXD-ENCD_3, TXD-ENCD_3, RE/DE/ENCD_3
U_MOSFET_Driver_Sheet3 = MOSFET_Driver_Sheet3.SchDoc: +24V, GND, MOTOR3_CONN (harness MOTOR3_CONN), M3_A, M3_B, M3_C, VDRAIN
U_Motor_Driver_Sheet3 = Motor_Driver_Sheet3.SchDoc: +24V, +3V3, GND, MOTOR3_CONN (harness MOTOR3_CONN), INHA_C, INHB_C, INHC_C, INLA_C, INLB_C, INLC_C, nSCS_C, SDI_C, SDO_C, SWO/SCK_C, SOC_C, SOB_C, SOA_C, CAL_C, ENABLE_C, VDRAIN, nFAULT_C
U_Sec_Controller_Sheet3 = Sec_Controller_Sheet3.SchDoc: +3V3, GND, INHA_C, INHB_C, INHC_C, INLA_C, INLB_C, INLC_C, nSCS_C, SDI_C, SDO_C, SWO/SCK_C, SOC_C, SOB_C, SOA_C, CAL_C, ENABLE_C, nFAULT_C, USART3_RX, USART3_TX, RXD-ENCD_3, TXD-ENCD_3, RE/DE/ENCD_3, MON1_3, MON2_3, SIG_5, SIG_6, DIGITAL3 (harness DIGITAL1), +5V

### Ports
EN3_N (see Top_Sheet[4B], Connector_Sheet[3D], Encoder_Sheet3[2D]), EN3_P (see Top_Sheet[4B], Connector_Sheet[3D], Encoder_Sheet3[2D]), M3_A (see Top_Sheet[4C], Connector_Sheet[4D], MOSFET_Driver_Sheet3[3D]), M3_B (see Top_Sheet[4C], Connector_Sheet[4D], MOSFET_Driver_Sheet3[3D]), M3_C (see Top_Sheet[4C], Connector_Sheet[4D], MOSFET_Driver_Sheet3[3D]), USART3_RX (see Top_Sheet[4B], Controller_Sheet[2D], Sec_Controller_Sheet3[1D]), USART3_TX (see Top_Sheet[4B], Controller_Sheet[2D], Sec_Controller_Sheet3[1D])

### Nets
+3V3: sheet U_Motor_Driver_Sheet3/+3V3, sheet U_Sec_Controller_Sheet3/+3V3, sheet U_Encoder_Sheet3/+3V3
+5V: sheet U_Sec_Controller_Sheet3/+5V, sheet U_Encoder_Sheet3/+5V, sheet U_DIO_3/+5V
+24V: sheet U_MOSFET_Driver_Sheet3/+24V, sheet U_MOSFET_Driver_Sheet3/VDRAIN, sheet U_Motor_Driver_Sheet3/+24V, sheet U_Motor_Driver_Sheet3/VDRAIN, sheet U_DIO_3/+24V  [project net VDRAIN]
GND: sheet U_MOSFET_Driver_Sheet3/GND, sheet U_Motor_Driver_Sheet3/GND, sheet U_Sec_Controller_Sheet3/GND, sheet U_Encoder_Sheet3/GND, sheet U_DIO_3/GND
CAL_C: sheet U_Motor_Driver_Sheet3/CAL_C, sheet U_Sec_Controller_Sheet3/CAL_C
EN3_N: port EN3_N, sheet U_Encoder_Sheet3/EN3_N
EN3_P: port EN3_P, sheet U_Encoder_Sheet3/EN3_P
ENABLE_C: sheet U_Motor_Driver_Sheet3/ENABLE_C, sheet U_Sec_Controller_Sheet3/ENABLE_C
INHA_C: sheet U_Motor_Driver_Sheet3/INHA_C, sheet U_Sec_Controller_Sheet3/INHA_C
INHB_C: sheet U_Motor_Driver_Sheet3/INHB_C, sheet U_Sec_Controller_Sheet3/INHB_C
INHC_C: sheet U_Motor_Driver_Sheet3/INHC_C, sheet U_Sec_Controller_Sheet3/INHC_C
INLA_C: sheet U_Motor_Driver_Sheet3/INLA_C, sheet U_Sec_Controller_Sheet3/INLA_C
INLB_C: sheet U_Motor_Driver_Sheet3/INLB_C, sheet U_Sec_Controller_Sheet3/INLB_C
INLC_C: sheet U_Motor_Driver_Sheet3/INLC_C, sheet U_Sec_Controller_Sheet3/INLC_C
M3_A: port M3_A, sheet U_MOSFET_Driver_Sheet3/M3_A
M3_B: port M3_B, sheet U_MOSFET_Driver_Sheet3/M3_B
M3_C: port M3_C, sheet U_MOSFET_Driver_Sheet3/M3_C
MON1_3: sheet U_Sec_Controller_Sheet3/MON1_3, sheet U_DIO_3/MON1_3
MON2_3: sheet U_Sec_Controller_Sheet3/MON2_3, sheet U_DIO_3/MON2_3
nFAULT_C: sheet U_Motor_Driver_Sheet3/nFAULT_C, sheet U_Sec_Controller_Sheet3/nFAULT_C
nSCS_C: sheet U_Motor_Driver_Sheet3/nSCS_C, sheet U_Sec_Controller_Sheet3/nSCS_C
RE/DE/ENCD_3: sheet U_Sec_Controller_Sheet3/RE/DE/ENCD_3, sheet U_Encoder_Sheet3/RE/DE/ENCD_3
RXD-ENCD_3: sheet U_Sec_Controller_Sheet3/RXD-ENCD_3, sheet U_Encoder_Sheet3/RXD-ENCD_3
SDI_C: sheet U_Motor_Driver_Sheet3/SDI_C, sheet U_Sec_Controller_Sheet3/SDI_C
SDO_C: sheet U_Motor_Driver_Sheet3/SDO_C, sheet U_Sec_Controller_Sheet3/SDO_C
SIG_5: sheet U_Sec_Controller_Sheet3/SIG_5, sheet U_DIO_3/SIG_5
SIG_6: sheet U_Sec_Controller_Sheet3/SIG_6, sheet U_DIO_3/SIG_6
SOA_C: sheet U_Motor_Driver_Sheet3/SOA_C, sheet U_Sec_Controller_Sheet3/SOA_C
SOB_C: sheet U_Motor_Driver_Sheet3/SOB_C, sheet U_Sec_Controller_Sheet3/SOB_C
SOC_C: sheet U_Motor_Driver_Sheet3/SOC_C, sheet U_Sec_Controller_Sheet3/SOC_C
SWO/SCK_C: sheet U_Motor_Driver_Sheet3/SWO/SCK_C, sheet U_Sec_Controller_Sheet3/SWO/SCK_C
TXD-ENCD_3: sheet U_Sec_Controller_Sheet3/TXD-ENCD_3, sheet U_Encoder_Sheet3/TXD-ENCD_3
USART3_RX: port USART3_RX, sheet U_Sec_Controller_Sheet3/USART3_RX
USART3_TX: port USART3_TX, sheet U_Sec_Controller_Sheet3/USART3_TX

### Buses and harness runs
harness sheet U_DIO_3/DIGITAL3 = sheet U_Sec_Controller_Sheet3/DIGITAL3
harness sheet U_MOSFET_Driver_Sheet3/MOTOR3_CONN = sheet U_Motor_Driver_Sheet3/MOTOR3_CONN

### Notes on the sheet
- File:
- Title:
- Date:
- Page
- Num:
- Total:
- Drawn By: Huzaifa Ali

## Sheet MOSFET_Driver_Sheet3.SchDoc
size 420 x 297 mm; SheetNumber: 24; SheetTotal: 32
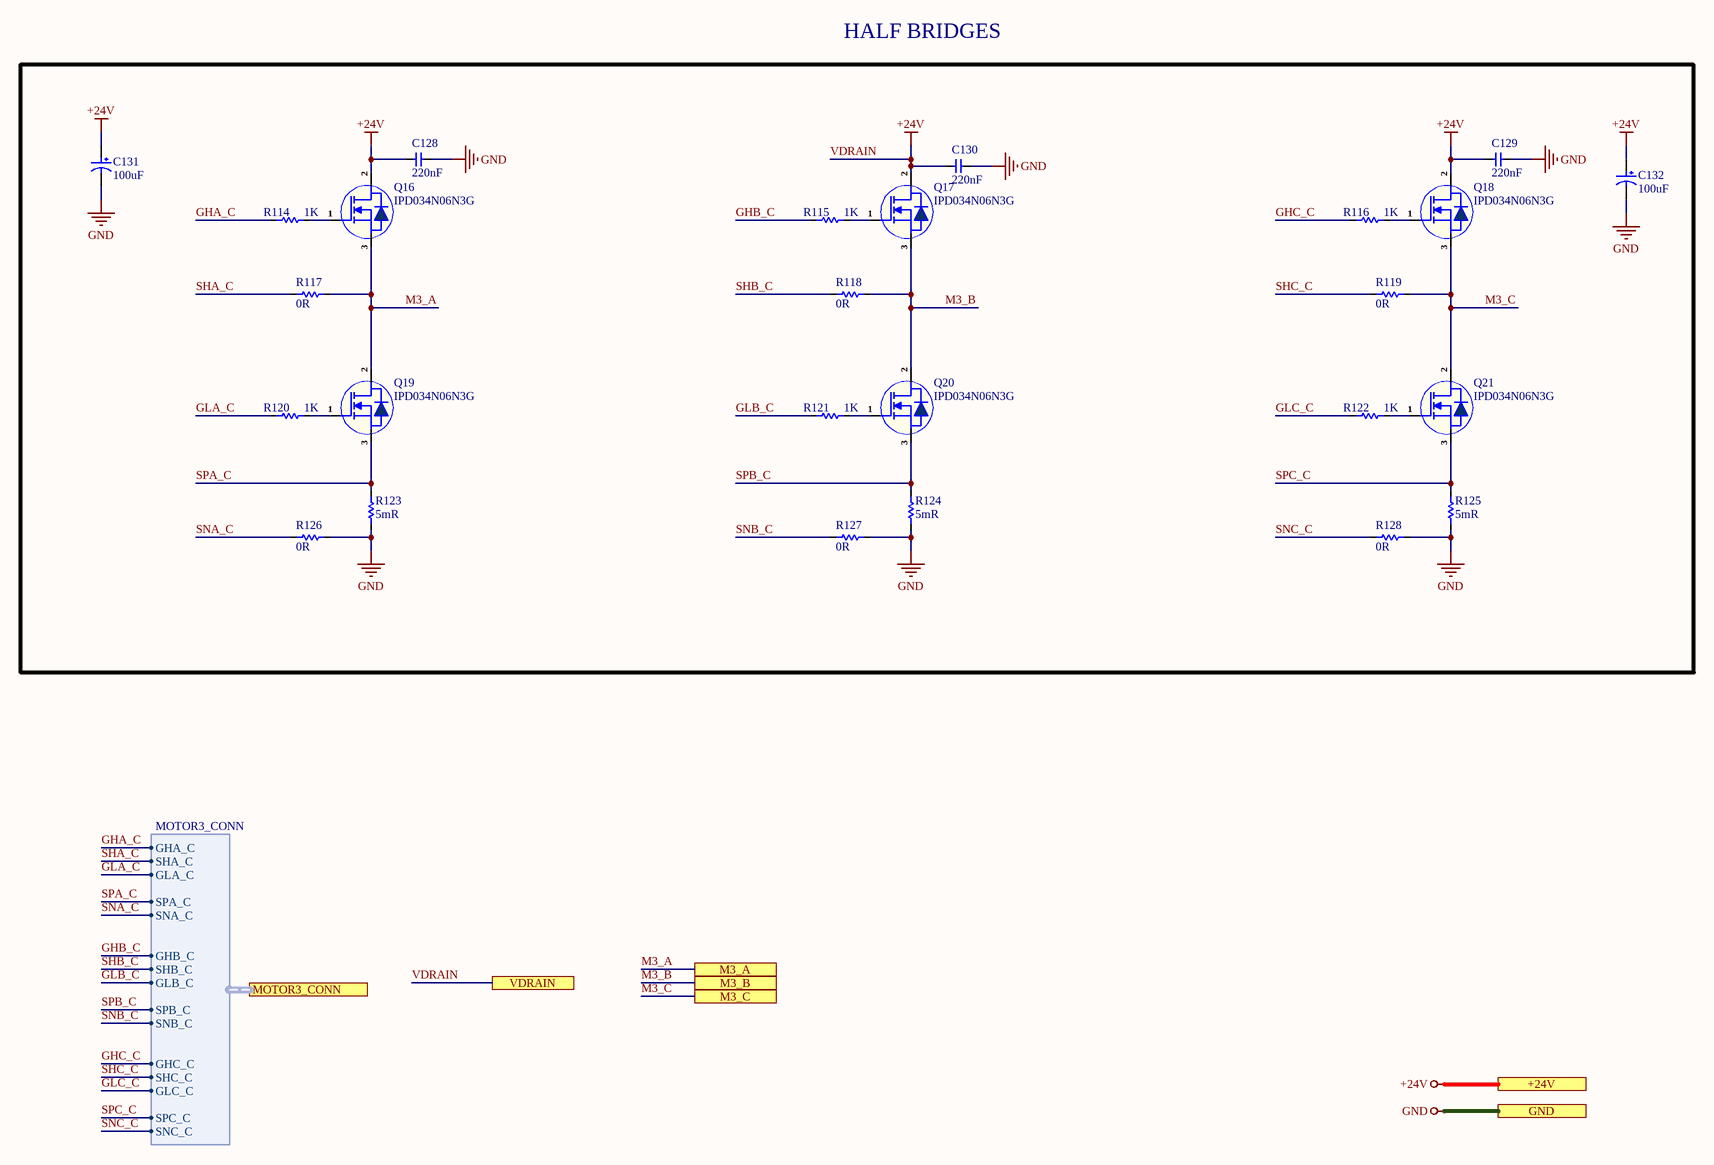
[diagram p21: MOSFET_Driver_Sheet3.SchDoc]

### Parts
C128  220nF  [Cap-0805]
C129  220nF  [Cap-0805]
C130  220nF  [Cap-0805]
C131  100uF  [RVT1A101M0605]
C132  100uF  [RVT1A101M0605]
Q16  IPD034N06N3G  [TO-252-2L]
Q17  IPD034N06N3G  [TO-252-2L]
Q18  IPD034N06N3G  [TO-252-2L]
Q19  IPD034N06N3G  [TO-252-2L]
Q20  IPD034N06N3G  [TO-252-2L]
Q21  IPD034N06N3G  [TO-252-2L]
R114  1K  [Res-0402]
R115  1K  [Res-0402]
R116  1K  [Res-0402]
R117  0R  [Res-0603]
R118  0R  [Res-0603]
R119  0R  [Res-0603]
R120  1K  [Res-0402]
R121  1K  [Res-0402]
R122  1K  [Res-0402]
R123  5mR  [Res-1206]
R124  5mR  [Res-1206]
R125  5mR  [Res-1206]
R126  0R  [Res-0603]
R127  0R  [Res-0603]
R128  0R  [Res-0603]

### Ports
+24V (see Servo3[4A], Connector_Sheet[5D], DIO_1[5D], DIO_2[5D], DIO_3[5D], DIO_4[5D], MOSFET_Driver_Sheet1[5D], MOSFET_Driver_Sheet2[5D], MOSFET_Driver_Sheet4[5D], Motor_Driver_Sheet1[5D], Motor_Driver_Sheet2[5D], Motor_Driver_Sheet3[5D], Motor_Driver_Sheet4[5D], Power_Sheet[5D]), GND (see Servo3[4B], CAN_Sheet[5D], Connector_Sheet[5D], Controller_Sheet[5D], DIO_1[5D], DIO_2[5D], DIO_3[5D], DIO_4[5D], Encoder_Sheet1[5D], Encoder_Sheet2[5D], Encoder_Sheet3[5D], Encoder_Sheet4[5D], EtherCAT_Sheet[5D], MOSFET_Driver_Sheet1[5D], MOSFET_Driver_Sheet2[5D], MOSFET_Driver_Sheet4[5D], Motor_Driver_Sheet1[5D], Motor_Driver_Sheet2[5D], Motor_Driver_Sheet3[5D], Motor_Driver_Sheet4[5D], Power_Sheet[5D], RJ45_Sheet[5D], RS485_RS232_Sheet[3D], Sec_Controller_Sheet1[5D], Sec_Controller_Sheet2[5D], Sec_Controller_Sheet3[5D], Sec_Controller_Sheet4[5D]), M3_A (see Servo3[5B], Connector_Sheet[4D], Servo3[5B]), M3_B (see Servo3[5B], Connector_Sheet[4D], Servo3[5B]), M3_C (see Servo3[5B], Connector_Sheet[4D], Servo3[5B]), MOTOR3_CONN (harness MOTOR3_CONN, see Servo3[4B], Motor_Driver_Sheet3[2D]), VDRAIN (see Servo3[4B], MOSFET_Driver_Sheet1[2D], MOSFET_Driver_Sheet2[2D], MOSFET_Driver_Sheet4[2D], Motor_Driver_Sheet1[2D], Motor_Driver_Sheet2[2D], Motor_Driver_Sheet3[2D], Motor_Driver_Sheet4[2D])

### Harnesses
MOTOR3_CONN: GHA_C, SHA_C, GLA_C, SPA_C, SNA_C, GHB_C, SHB_C, GLB_C, SPB_C, SNB_C, GHC_C, SHC_C, GLC_C, SPC_C, SNC_C

### Nets
GND: C128.1 C129.1 C130.1 C131.2 C132.2 R123.1 R124.1 R125.1 R126.1 R127.1 R128.1 ; port GND
VDRAIN: C128.2 C129.2 C130.2 C131.1 C132.1 Q16.2(D) Q17.2(D) Q18.2(D) ; port +24V, port VDRAIN  [also labelled +24V]
GHA_C: R114.1 ; port MOTOR3_CONN.GHA_C
GHB_C: R115.1 ; port MOTOR3_CONN.GHB_C
GHC_C: R116.1 ; port MOTOR3_CONN.GHC_C
GLA_C: R120.1 ; port MOTOR3_CONN.GLA_C
GLB_C: R121.1 ; port MOTOR3_CONN.GLB_C
GLC_C: R122.1 ; port MOTOR3_CONN.GLC_C
M3_A: Q16.3(S) Q19.2(D) R117.1 ; port M3_A
M3_B: Q17.3(S) Q20.2(D) R118.1 ; port M3_B
M3_C: Q18.3(S) Q21.2(D) R119.1 ; port M3_C
SHA_C: R117.2 ; port MOTOR3_CONN.SHA_C
SHB_C: R118.2 ; port MOTOR3_CONN.SHB_C
SHC_C: R119.2 ; port MOTOR3_CONN.SHC_C
SNA_C: R126.2 ; port MOTOR3_CONN.SNA_C
SNB_C: R127.2 ; port MOTOR3_CONN.SNB_C
SNC_C: R128.2 ; port MOTOR3_CONN.SNC_C
SPA_C: Q19.3(S) R123.2 ; port MOTOR3_CONN.SPA_C
SPB_C: Q20.3(S) R124.2 ; port MOTOR3_CONN.SPB_C
SPC_C: Q21.3(S) R125.2 ; port MOTOR3_CONN.SPC_C
NetQ16_1: Q16.1(G) R114.2
NetQ17_1: Q17.1(G) R115.2
NetQ18_1: Q18.1(G) R116.2
NetQ19_1: Q19.1(G) R120.2
NetQ20_1: Q20.1(G) R121.2
NetQ21_1: Q21.1(G) R122.2

### Notes on the sheet
- HALF BRIDGES
- File:
- Title:
- Date:
- Page
- Num:
- Total:
- Drawn By: Huzaifa Ali

### Library data of the parts
C128-C130 = 08051C224K4T2A: as C123-C125 on sheet MOSFET_Driver_Sheet2; Supplier 1: Digi-Key; Manufacturer Part Number: 08051C224K4T2A; RoHS: Yes; Category: Ceramic Capacitors; Stock 1: 151; Pricing 1: 1=0.27000, 10=0.18500, 50=0.12320, 100=0.10470, 500=0.07392, 1000=0.06468 (USD); Mount: Surface Mount; Case/Package: 0805; Contact Plating: Tin; Min Operating Temperature: -55°C; Max Operating Temperature: 125°C; Termination: Wraparound; Capacitance: 220nF; Dielectric: X7R; Voltage Rating (DC): 100V; Length: 2.01mm; RoHS Compliant: Yes; ComponentLink1URL: http://datasheets.avx.com/AutoMLCC.pdf?src-supplier=Avnet+Asia; ComponentLink1Description: http://datasheets.avx.com/AutoMLCC.pdf?src-supplier=Avnet+Asia; Supplier Part Number 1: 478-13049-1-ND; LCSC Part Number: C2176107
C131 C132 = RVT1A101M0605: as C126 on sheet MOSFET_Driver_Sheet2; Manufacturer Part Number: RVT1A101M0605; Package: SMD,D6.3xL5.4mm; LCSC Part Number: C72474; Item Type: Capacitor; ComponentLink1Description: LCSC; ComponentLink1URL: https://www.lcsc.com/product-detail/Aluminum-Electrolytic-Capacitors-SMD_ROQANG-RVT1A101M0605_C72474.html
Q16-Q21 = IPD034N06N3G: as Q10-Q15 on sheet MOSFET_Driver_Sheet2; Supplier: Mouser; Supplier Part Number: 726-IPD034N06N3G; Manufacturer Part Number: IPD034N06N3G; RoHS: Yes; Stock: 7587; Pricing: 1=1.76, 10=1.48, 50=1.48, 100=1.2, 1000=0.837, 10000=0.747 (USD); LCSC Part Number: C94897; Item Type: Mosfet
R114-R116 R120-R122 = RC0402FR-071KL: as R99-R101 on sheet MOSFET_Driver_Sheet2; Supplier 1: Avnet; Manufacturer Part Number: RC0402FR-071KL; RoHS: Yes; Category: Chip SMD Resistors; Stock 1: 13030000; Pricing 1: 10000=0.00085, 20000=0.00087, 40000=0.00084, 60000=0.00083, 80000=0.00079, 100000=0.00078, 1000000=0.00076 (USD); Case/Package: 0402; Number of Pins: 2; Case Code (Imperial): 0402; Case Code (Metric): 1005; Size Code: 0402; Min Operating Temperature: -55°C; Max Operating Temperature: 155°C; Resistor Type: Thick Film; Tolerance: 1%; Packaging: Tape and Reel; Voltage Rating: 50V; Termination: SMD/SMT; Features: Moisture Resistant; Series: RC; Number of Terminations: 2; Resistance Tolerance: 1%; Construction: Rectangular; Technology: THICK FILM; Length: 1mm; Width: 0.5mm; Height: 0.32mm; Depth: 0.5mm; Reach SVHC Compliant: Yes; Lead Free: Lead Free; RoHS Compliant: Yes; Military Standard: Not; ComponentLink1URL: https://datasheet.ciiva.com/11819/0900766b80c66297-11819477.pdf?src-supplier=RSComponents; ComponentLink1Description: https://datasheet.ciiva.com/11819/0900766b80c66297-11819477.pdf?src-supplier=RSComponents; ComponentLink2URL: https://datasheet.ciiva.com/7983/1018594-7983502.pdf?src-supplier=Element14; ComponentLink2Description: https://datasheet.ciiva.com/7983/1018594-7983502.pdf?src-supplier=Element14; ComponentLink3URL: https://datasheet.ciiva.com/22747/1018594-22747513.pdf?src-supplier=Element14; ComponentLink3Description: https://datasheet.ciiva.com/22747/1018594-22747513.pdf?src-supplier=Element14; ComponentLink4URL: https://datasheet.ciiva.com/12666/pyu-rc0402-51-rohs-l-6-r-12666741.pdf?src-supplier=Mouser; ComponentLink4Description: https://datasheet.ciiva.com/12666/pyu-rc0402-51-rohs-l-6-r-12666741.pdf?src-supplier=Mouser; ComponentLink5URL: https://datasheet.ciiva.com/7849/1018594-7849869.pdf?src-supplier=Element14; ComponentLink5Description: https://datasheet.ciiva.com/7849/1018594-7849869.pdf?src-supplier=Element14; ComponentLink6URL: https://datasheet.ciiva.com/7849/1018594-7849871.pdf?src-supplier=Element14; ComponentLink6Description: https://datasheet.ciiva.com/7849/1018594-7849871.pdf?src-supplier=Element14; ComponentLink7URL: https://datasheet.ciiva.com/17063/pyu-rc0402-51-rohs-l-6-r-17063193.pdf?src-supplier=Future+Electronics; ComponentLink7Description: https://datasheet.ciiva.com/17063/pyu-rc0402-51-rohs-l-6-r-17063193.pdf?src-supplier=Future+Electronics; Supplier Part Number 1: RC0402FR-071KL; LCSC Part Number: C106235
R117-R119 R126-R128 = RC0603JR-070RL: as R55-R57 on sheet Sec_Controller_Sheet2; Supplier 1: Digi-Key; Manufacturer Part Number: RC0603JR-070RL; RoHS: Yes; Category: Chip SMD Resistors; Stock 1: 18081776; Pricing 1: 1=0.10000, 10=0.01700, 25=0.01240, 50=0.00960, 100=0.00700, 250=0.00536, 500=0.00430, 1000=0.00316 (USD); Case/Package: 0603; Number of Pins: 2; Contact Plating: Tin,Matte; Case Code (Imperial): 0603; Case Code (Metric): 1608; Size Code: 0603; Min Operating Temperature: -55°C; Max Operating Temperature: 155°C; Resistor Type: Thick Film; Packaging: Tape and Reel; Termination: SMD/SMT; Series: RC; Technology: THICK FILM; Package Quantity: 5000; Voltage Rating: 50V; Features: Moisture Resistant; Max Power Dissipation: 100mW; Number of Terminations: 2; Construction: Rectangular; Length: 1.6mm; Width: 0.8mm; Height: 0.45mm; Depth: 0.8mm; Radiation Hardening: No; Reach SVHC Compliant: No SVHC; Lead Free: Lead Free; RoHS Compliant: Yes; Military Standard: Not; Supplier Part Number 1: 311-0.0GRCT-ND; LCSC Part Number: C95177
R123-R125 = CUM1206-15FR005: as R108-R110 on sheet MOSFET_Driver_Sheet2; Manufacturer Part Number: CUM1206-15FR005; Package: 1206; LCSC Part Number: C5185588; ComponentLink1Description: LCSC; ComponentLink1URL: https://www.lcsc.com/product-detail/Current-Sense-Resistors-Shunt-Resistors_FORT-CUM1206-15FR005_C5185588.html